# EAGLE schematic Washer Control Board (EAGLE 7.2.0)

## Sheet 1 of 3
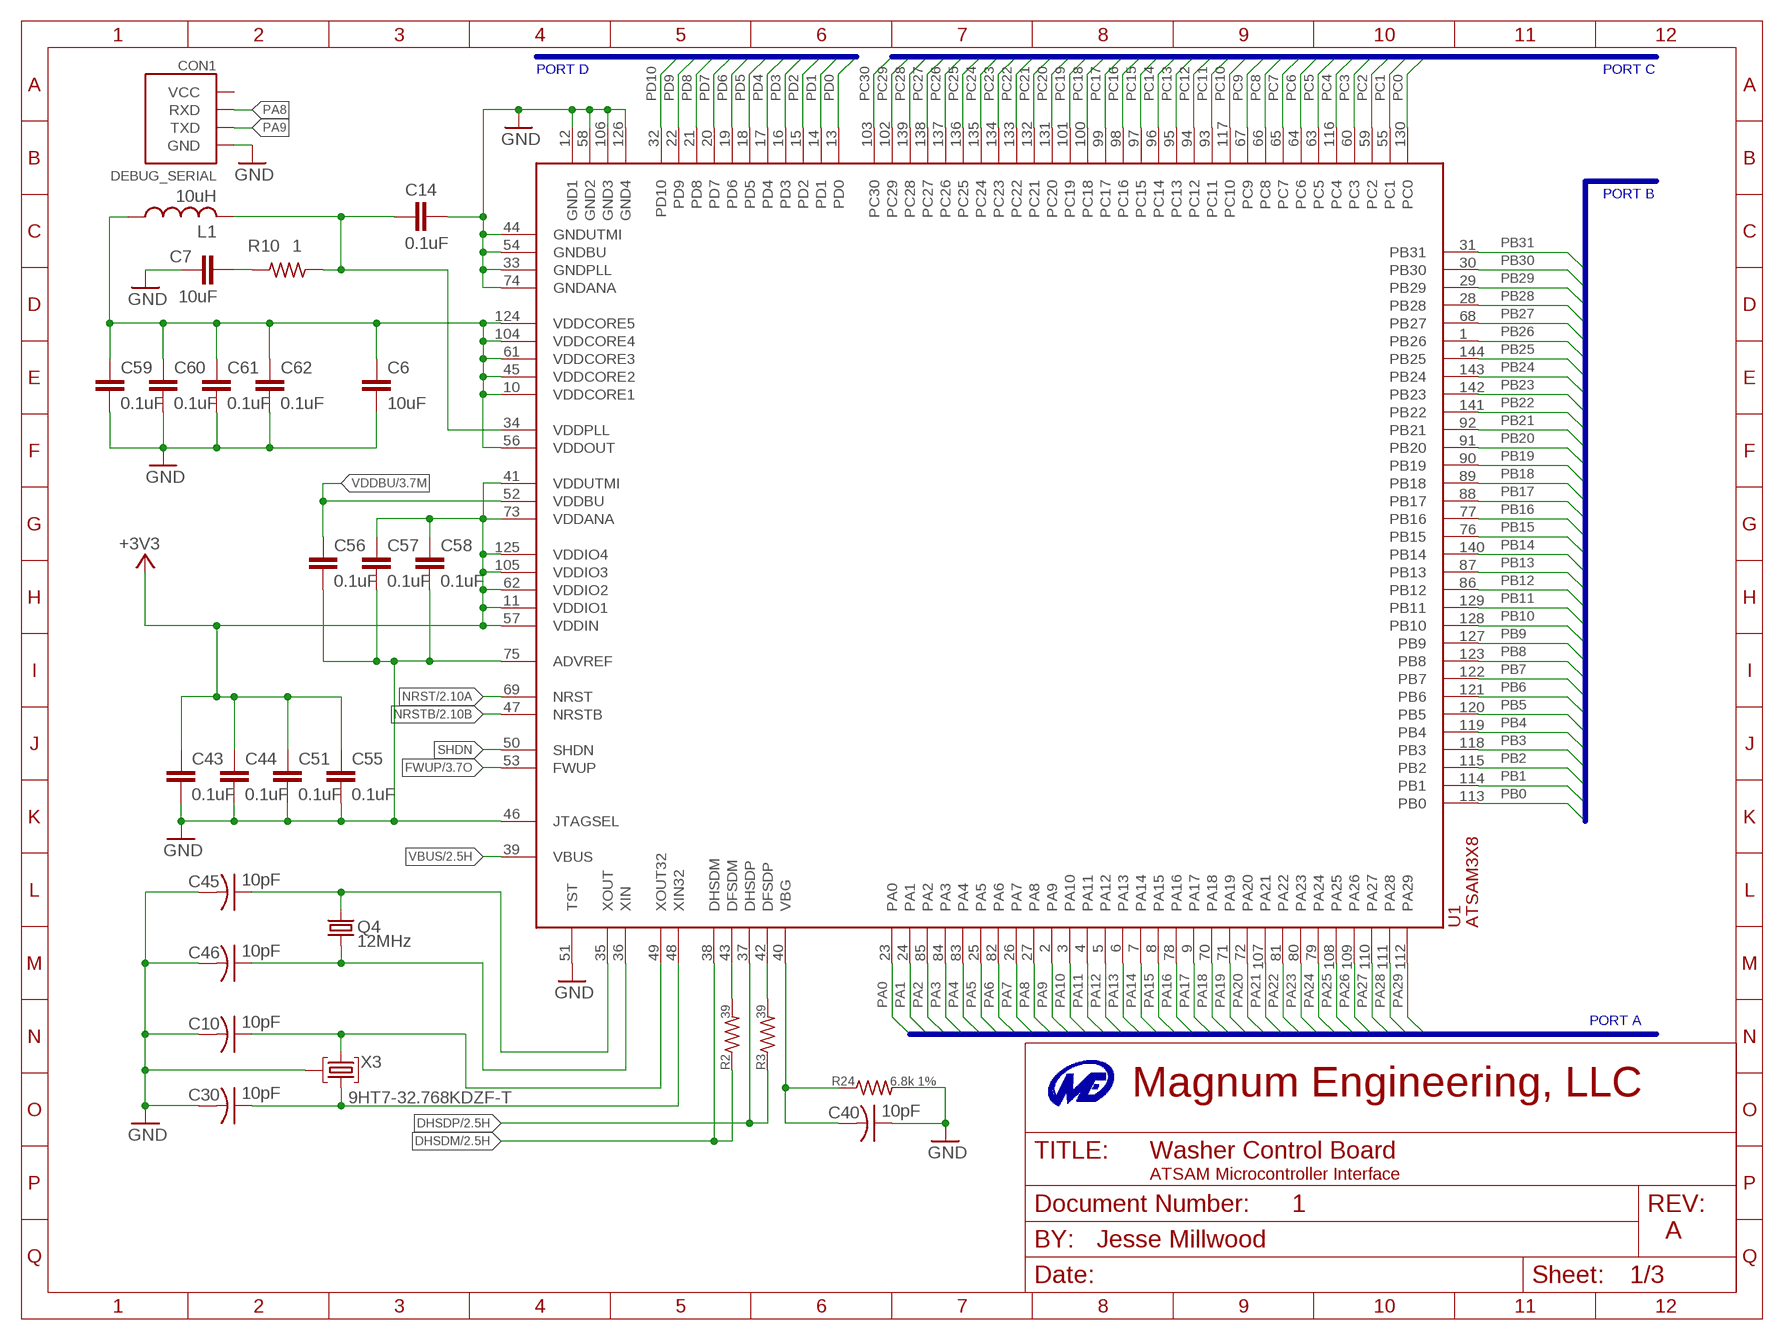
[diagram p0: schematic, sheet 1]
FRAME1 (MAGNUM-FRAME): AUTHOR: Jesse Millwood; DOC_NUM: 1; REV: A; SHEET_NAME: ATSAM Microcontroller Interface

### Parts
C6  10uF  C-EUC0805  [C0805]
C7  10uF  C-EUC0805  [C0805]
C10  10pF  CAPACITOR0805  [C0805]
C14  0.1uF  C-EUC0805  [C0805]
C30  10pF  CAPACITOR0805  [C0805]
C40  10pF  CAPACITOR0805  [C0805]
C43  0.1uF  C-EUC0805  [C0805]
C44  0.1uF  C-EUC0805  [C0805]
C45  10pF  CAPACITOR0805  [C0805]
C46  10pF  CAPACITOR0805  [C0805]
C51  0.1uF  C-EUC0805  [C0805]
C55  0.1uF  C-EUC0805  [C0805]
C56  0.1uF  C-EUC0805  [C0805]
C57  0.1uF  C-EUC0805  [C0805]
C58  0.1uF  C-EUC0805  [C0805]
C59  0.1uF  C-EUC0805  [C0805]
C60  0.1uF  C-EUC0805  [C0805]
C61  0.1uF  C-EUC0805  [C0805]
C62  0.1uF  C-EUC0805  [C0805]
CON1  DEBUG_SERIAL  VIDEO_PARTS_DEBUG_SERIAL  [VIDEO_PARTS_DEBUG_SERIAL]
L1  10uH  L-USL2012C  [L2012C]
Q4  12MHz  CRYSTALHC49UP  [HC49UP]
R2  39  RESISTOR0805  [R0805]
R3  39  RESISTOR0805  [R0805]
R10  1  R-US_R0805  [R0805]
R24  6.8k 1%  RESISTOR0805  [R0805]
U1  ATSAM3X8  SMARTPRJ_ATSAM3X/AAU  [SMARTPRJ_LQFP144]
X3  9HT7-32.768KDZF-T  CRYSTAL  [TXC-9HT7]

### Nets
+3V3: C43.1 C44.1 C51.1 C55.1 C57.1 C58.1 U1.11(VDDIO1) U1.41(VDDUTMI) U1.57(VDDIN) U1.62(VDDIO2) U1.73(VDDANA) U1.105(VDDIO3) U1.125(VDDIO4) ; also sheet 2,3
DHSDM: R2.1 U1.38(DHSDM) ; also sheet 2
DHSDP: R3.1 U1.37(DHSDP) ; also sheet 2
FWUP: U1.53(FWUP) ; also sheet 3
GND: C6.2 C7.1 C10.2 C14.2 C30.2 C40.1 C43.2 C44.2 C45.2 C46.2 C51.2 C55.2 C56.2 C57.2 C58.2 C59.2 C60.2 C61.2 C62.2 CON1.GND R24.2 U1.12(GND1) U1.33(GNDPLL) U1.44(GNDUTMI) U1.46(JTAGSEL) U1.51(TST) U1.54(GNDBU) U1.58(GND2) U1.74(GNDANA) U1.75(ADVREF) U1.106(GND3) U1.126(GND4) X3.2(GND) X3.3(GND) ; also sheet 2,3
N$6: C7.2 R10.2
N$8: C14.1 L1.2 R10.1 U1.34(VDDPLL)
N$9: R2.2 U1.43(DFSDM)
N$10: R3.2 U1.42(DFSDP)
N$45: C40.2 R24.1 U1.40(VBG)
N$51: C30.1 U1.48(XIN32) X3.1(X1)
N$55: C46.1 Q4.1 U1.36(XIN)
N$56: C45.1 Q4.2 U1.35(XOUT)
N$78: C10.1 U1.49(XOUT32) X3.4(X2)
NRST: U1.69(NRST) ; also sheet 2
NRSTB: U1.47(NRSTB) ; also sheet 2
PA0: U1.23(PA0) ; also sheet 2
PA1: U1.24(PA1) ; also sheet 2
PA2: U1.85(PA2) ; also sheet 2
PA3: U1.84(PA3)
PA4: U1.83(PA4)
PA5: U1.25(PA5)
PA6: U1.82(PA6) ; also sheet 2
PA7: U1.26(PA7)
PA8: CON1.RXD U1.27(PA8)
PA9: CON1.TXD U1.2(PA9)
PA10: U1.3(PA10)
PA11: U1.4(PA11)
PA12: U1.5(PA12)
PA13: U1.6(PA13)
PA14: U1.7(PA14)
PA15: U1.8(PA15)
PA16: U1.78(PA16)
PA17: U1.9(PA17)
PA18: U1.70(PA18)
PA19: U1.71(PA19) ; also sheet 2
PA20: U1.72(PA20) ; also sheet 2
PA21: U1.107(PA21) ; also sheet 2
PA22: U1.81(PA22) ; also sheet 2
PA23: U1.80(PA23) ; also sheet 2
PA24: U1.79(PA24)
PA25: U1.108(PA25)
PA26: U1.109(PA26)
PA27: U1.110(PA27)
PA28: U1.111(PA28)
PA29: U1.112(PA29)
PB0: U1.113(PB0) ; also sheet 2
PB1: U1.114(PB1) ; also sheet 2
PB2: U1.115(PB2) ; also sheet 2
PB3: U1.118(PB3) ; also sheet 2
PB4: U1.119(PB4) ; also sheet 2
PB5: U1.120(PB5) ; also sheet 2
PB6: U1.121(PB6) ; also sheet 2
PB7: U1.122(PB7) ; also sheet 2
PB8: U1.123(PB8) ; also sheet 2
PB9: U1.127(PB9) ; also sheet 2
PB10: U1.128(PB10) ; also sheet 2
PB11: U1.129(PB11)
PB12: U1.86(PB12)
PB13: U1.87(PB13)
PB14: U1.140(PB14)
PB15: U1.76(PB15)
PB16: U1.77(PB16) ; also sheet 2
PB17: U1.88(PB17) ; also sheet 2
PB18: U1.89(PB18) ; also sheet 2
PB19: U1.90(PB19) ; also sheet 2
PB20: U1.91(PB20) ; also sheet 2
PB21: U1.92(PB21)
PB22: U1.141(PB22)
PB23: U1.142(PB23)
PB24: U1.143(PB24)
PB25: U1.144(PB25) ; also sheet 3
PB26: U1.1(PB26)
PB27: U1.68(PB27)
PB28: U1.28(PB28) ; also sheet 2
PB29: U1.29(PB29) ; also sheet 2
PB30: U1.30(PB30)
PB31: U1.31(PB31) ; also sheet 2
PC0: U1.130(PC0) ; also sheet 2
PC1: U1.55(PC1)
PC2: U1.59(PC2) ; also sheet 2
PC3: U1.60(PC3) ; also sheet 2
PC4: U1.116(PC4) ; also sheet 2
PC5: U1.63(PC5) ; also sheet 2
PC6: U1.64(PC6) ; also sheet 2
PC7: U1.65(PC7) ; also sheet 2
PC8: U1.66(PC8) ; also sheet 2
PC9: U1.67(PC9) ; also sheet 2
PC10: U1.117(PC10)
PC11: U1.93(PC11)
PC12: U1.94(PC12)
PC13: U1.95(PC13)
PC14: U1.96(PC14)
PC15: U1.97(PC15)
PC16: U1.98(PC16)
PC17: U1.99(PC17)
PC18: U1.100(PC18)
PC19: U1.101(PC19) ; also sheet 2
PC20: U1.131(PC20) ; also sheet 2
PC21: U1.132(PC21) ; also sheet 3
PC22: U1.133(PC22) ; also sheet 2
PC23: U1.134(PC23)
PC24: U1.135(PC24)
PC25: U1.136(PC25)
PC26: U1.137(PC26)
PC27: U1.138(PC27)
PC28: U1.139(PC28)
PC29: U1.102(PC29)
PC30: U1.103(PC30)
PD0: U1.13(PD0)
PD1: U1.14(PD1)
PD2: U1.15(PD2)
PD3: U1.16(PD3)
PD4: U1.17(PD4)
PD5: U1.18(PD5)
PD6: U1.19(PD6)
PD7: U1.20(PD7)
PD8: U1.21(PD8) ; also sheet 2
PD9: U1.22(PD9) ; also sheet 2
PD10: U1.32(PD10)
SHDN: U1.50(SHDN)
VBUS: U1.39(VBUS) ; also sheet 2
VDDBU: C56.1 U1.52(VDDBU) ; also sheet 3
VDDCORE: C6.1 C59.1 C60.1 C61.1 C62.1 L1.1 U1.10(VDDCORE1) U1.45(VDDCORE2) U1.56(VDDOUT) U1.61(VDDCORE3) U1.104(VDDCORE4) U1.124(VDDCORE5)
Unconnected: CON1.VCC

### Buses
PB0,PB1,PB2,PB3,PB4,PB5,PB6,PB7,PB8,PB9,PB10,PB11,PB12,PB13,PB14,PB15,PB16,PB17,PB18,PB19,PB20,PB21,PB22,PB23,PB24,PB25,PB26,PB27,PB28,PB29,PB30,PB31
PC0,PC1,PC2,PC3,PC4,PC5,PC6,PC7,PC8,PC9,PC9,PC10,PC11,PC12,PC13,PC14,PC15,PC16,PC17,PC18,PC19,PC20,PC21,PC22,PC23,PC24,PC25,PC26,PC27,PC28,PC29,PC30
PD0,PD1,PD2,PD3,PD4,PD5,PD6,PD7,PD8,PD9,PD10
PA0,PA1,PA2,PA3,PA4,PA5,PA6,PA7,PA8,PA9,PA10,PA10,PA11,PA12,PA13,PA14,PA15,PA16,PA17,PA18,PA19,PA20,PA21,PA22,PA23,PA24,PA25,PA26,PA27,PA28,PA29

### Notes on the sheet
- PORT D | PORT C
- PORT B
- PORT A

## Sheet 2 of 3
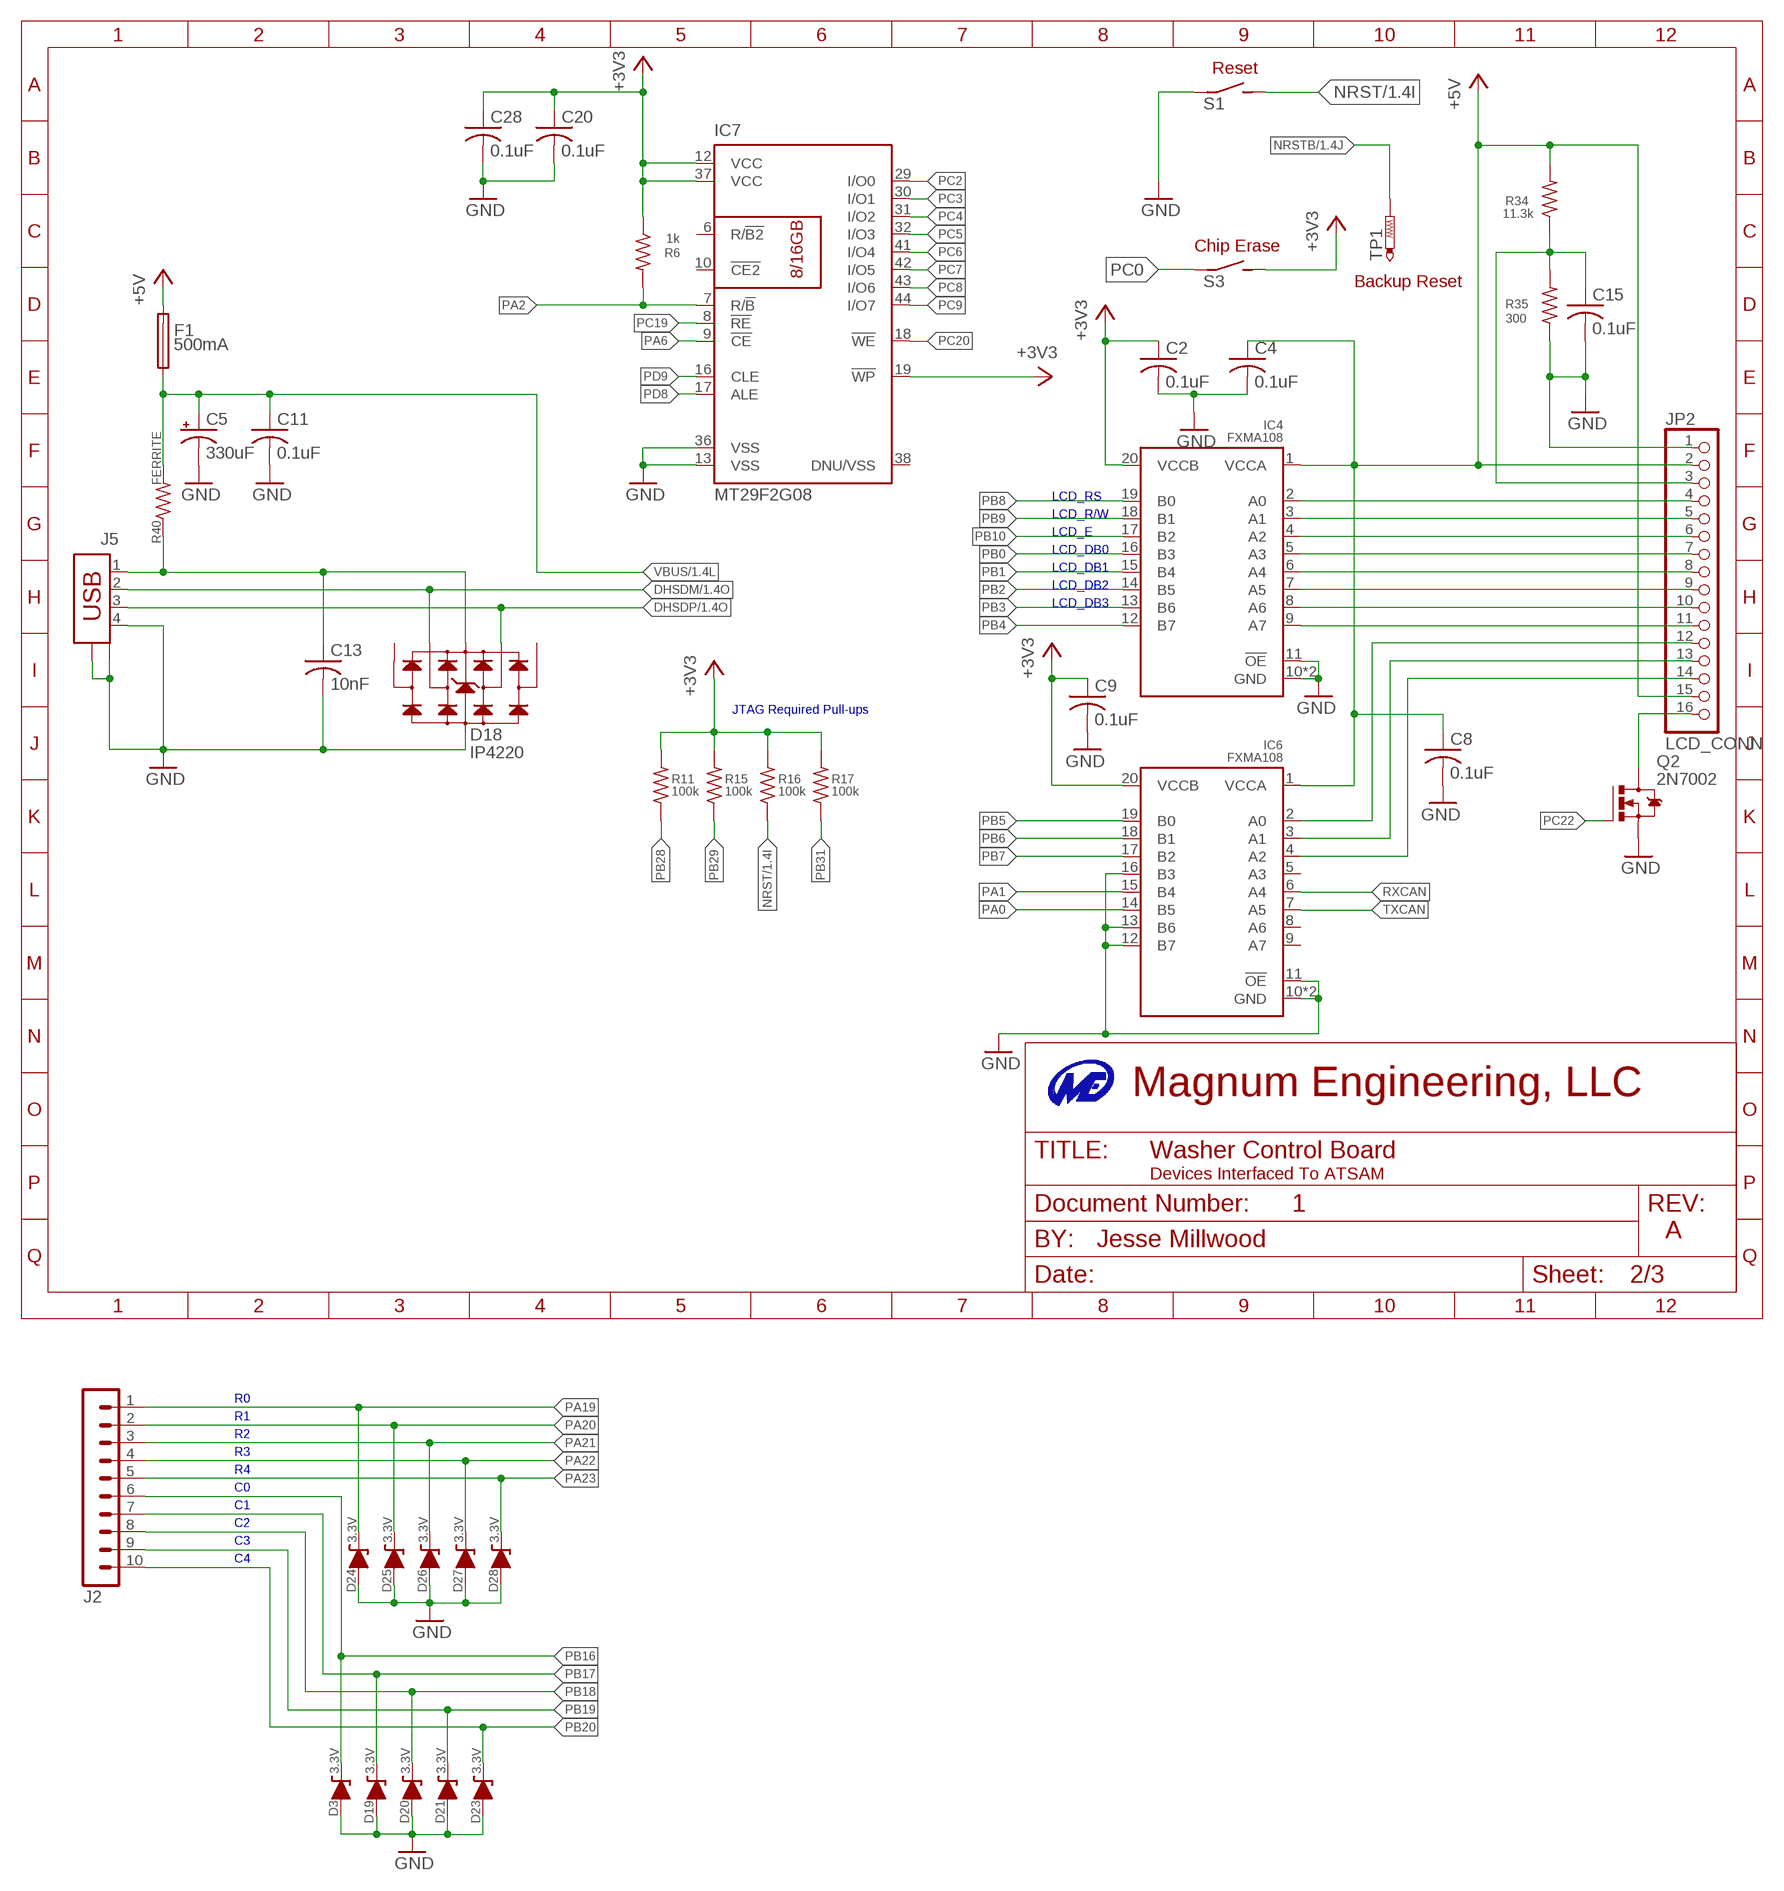
[diagram p1: schematic, sheet 2]
FRAME2 (MAGNUM-FRAME): AUTHOR: Jesse Millwood; DOC_NUM: 1; REV: A; SHEET_NAME: Devices Interfaced To ATSAM

### Parts
C2  0.1uF  CAPACITOR0805  [C0805]
C4  0.1uF  CAPACITOR0805  [C0805]
C5  330uF  CPOL-USE2.5-6  [E2,5-6]
C8  0.1uF  CAPACITOR0805  [C0805]
C9  0.1uF  CAPACITOR0805  [C0805]
C11  0.1uF  CAPACITOR0805  [C0805]
C13  10nF  CAPACITOR0805  [C0805]
C15  0.1uF  CAPACITOR0805  [C0805]
C20  0.1uF  CAPACITOR0805  [C0805]
C28  0.1uF  CAPACITOR0805  [C0805]
D3  3.3V  ZENERSOT-23  [SOT-23]
D18  IP4220  [SOT-23-6]
D19  3.3V  ZENERSOT-23  [SOT-23]
D20  3.3V  ZENERSOT-23  [SOT-23]
D21  3.3V  ZENERSOT-23  [SOT-23]
D23  3.3V  ZENERSOT-23  [SOT-23]
D24  3.3V  ZENERSOT-23  [SOT-23]
D25  3.3V  ZENERSOT-23  [SOT-23]
D26  3.3V  ZENERSOT-23  [SOT-23]
D27  3.3V  ZENERSOT-23  [SOT-23]
D28  3.3V  ZENERSOT-23  [SOT-23]
F1  500mA  FUSELITTELFUSE1812  [LITTELFUSE1812]
IC4  FXMA108  [20DQFN]
IC6  FXMA108  [20DQFN]
IC7  MT29F2G08  MT29F8G08DAA  [TSOP48]
J2  MA10-152271  [52271-1069]
J5  USB-787616  [USB]
JP2  LCD_CONN  PINHD-1X16  [1X16]
Q2  2N7002  [SOT-23]
R6  1k  R-US_R0805  [R0805]
R11  100k  RESISTOR0805  [R0805]
R15  100k  RESISTOR0805  [R0805]
R16  100k  RESISTOR0805  [R0805]
R17  100k  RESISTOR0805  [R0805]
R34  11.3k  R-US_R0805  [R0805]
R35  300  R-US_R0805  [R0805]
R40  FERRITE  RESISTOR0805  [R0805]
S1  Reset  SPST2EVQPJ  [EVQPJ]
S3  Chip Erase  SPST2EVQPJ  [EVQPJ]
TP1  PTR1TP06R  [TP06R]

### Nets
+3V3: C2.1 C9.1 C20.1 C28.1 IC4.20(VCCB) IC6.20(VCCB) IC7.12(VCC) IC7.19(!WP) IC7.37(VCC) R6.1 R11.2 R15.2 R16.2 R17.2 S3.B ; also sheet 1,3
+5V [Power]: C4.1 C8.1 F1.P$2 IC4.1(VCCA) IC6.1(VCCA) JP2.2 JP2.15 R34.2 ; also sheet 3
DHSDM: D18.6 J5.2 ; also sheet 1
DHSDP: D18.4 J5.3 ; also sheet 1
GND: C2.2 C4.2 C5.- C8.2 C9.2 C11.2 C13.2 C15.2 C20.2 C28.2 D3.1(A) D18.2(GND) D19.1(A) D20.1(A) D21.1(A) D23.1(A) D24.1(A) D25.1(A) D26.1(A) D27.1(A) D28.1(A) IC4.10(GND) IC4.11(!OE) IC4.PAD(GND) IC6.10(GND) IC6.11(!OE) IC6.12(B7) IC6.13(B6) IC6.16(B3) IC6.PAD(GND) IC7.13(VSS) IC7.36(VSS) J5.4 J5.P$1 J5.P$2 JP2.1 Q2.2(S) R35.1 S1.A ; also sheet 1,3
N$3: IC4.9(A7) JP2.11
N$12: IC6.2(A0) JP2.12
N$18: IC4.2(A0) JP2.4
N$24: IC4.3(A1) JP2.5
N$26: IC4.4(A2) JP2.6
N$34: IC4.5(A3) JP2.7
N$35: IC4.6(A4) JP2.8
N$39: IC6.3(A1) JP2.13
N$40: IC6.4(A2) JP2.14
N$41: IC4.7(A5) JP2.9
N$42: IC4.8(A6) JP2.10
N$44: JP2.16 Q2.3(D)
N$46: C15.1 JP2.3 R34.1 R35.2
NRST: R16.1 S1.B ; also sheet 1
NRSTB: TP1.TP ; also sheet 1
PA0: IC6.14(B5) ; also sheet 1
PA1: IC6.15(B4) ; also sheet 1
PA2: IC7.7(R/!B) R6.2 ; also sheet 1
PA6: IC7.9(!CE) ; also sheet 1
PA19: D24.3(K) J2.1 ; also sheet 1
PA20: D25.3(K) J2.2 ; also sheet 1
PA21: D26.3(K) J2.3 ; also sheet 1
PA22: D27.3(K) J2.4 ; also sheet 1
PA23: D28.3(K) J2.5 ; also sheet 1
PB0: IC4.16(B3) ; also sheet 1
PB1: IC4.15(B4) ; also sheet 1
PB2: IC4.14(B5) ; also sheet 1
PB3: IC4.13(B6) ; also sheet 1
PB4: IC4.12(B7) ; also sheet 1
PB5: IC6.19(B0) ; also sheet 1
PB6: IC6.18(B1) ; also sheet 1
PB7: IC6.17(B2) ; also sheet 1
PB8: IC4.19(B0) ; also sheet 1
PB9: IC4.18(B1) ; also sheet 1
PB10: IC4.17(B2) ; also sheet 1
PB16: D3.3(K) J2.6 ; also sheet 1
PB17: D19.3(K) J2.7 ; also sheet 1
PB18: D20.3(K) J2.8 ; also sheet 1
PB19: D21.3(K) J2.9 ; also sheet 1
PB20: D23.3(K) J2.10 ; also sheet 1
PB28: R11.1 ; also sheet 1
PB29: R15.1 ; also sheet 1
PB31: R17.1 ; also sheet 1
PC0: S3.A ; also sheet 1
PC2: IC7.29(I/O0) ; also sheet 1
PC3: IC7.30(I/O1) ; also sheet 1
PC4: IC7.31(I/O2) ; also sheet 1
PC5: IC7.32(I/O3) ; also sheet 1
PC6: IC7.41(I/O4) ; also sheet 1
PC7: IC7.42(I/O5) ; also sheet 1
PC8: IC7.43(I/O6) ; also sheet 1
PC9: IC7.44(I/O7) ; also sheet 1
PC19: IC7.8(!RE) ; also sheet 1
PC20: IC7.18(!WE) ; also sheet 1
PC22: Q2.1(G) ; also sheet 1
PD8: IC7.17(ALE) ; also sheet 1
PD9: IC7.16(CLE) ; also sheet 1
RXCAN: IC6.6(A4)
TXCAN: IC6.7(A5)
USB_V+: C13.1 D18.5(VBUS) J5.1 R40.1
VBUS: C5.+ C11.1 F1.P$1 R40.2 ; also sheet 1
Unconnected: D18.1 D18.3 IC6.5(A3) IC6.8(A6) IC6.9(A7) IC7.6(R/!B2) IC7.10(!CE2) IC7.25(DNU) IC7.26(DNU) IC7.38(DNU/VSS) IC7.48(DNU)

### Notes on the sheet
- Reset
- Chip Erase
- Backup Reset
- LCD_RS
- LCD_R/W
- LCD_E
- LCD_DB0
- LCD_DB1
- LCD_DB2
- LCD_DB3
- JTAG Required Pull-ups
- R0
- R1
- R2
- R3
- R4
- C0
- C1
- C2
- C3
- C4

## Sheet 3 of 3
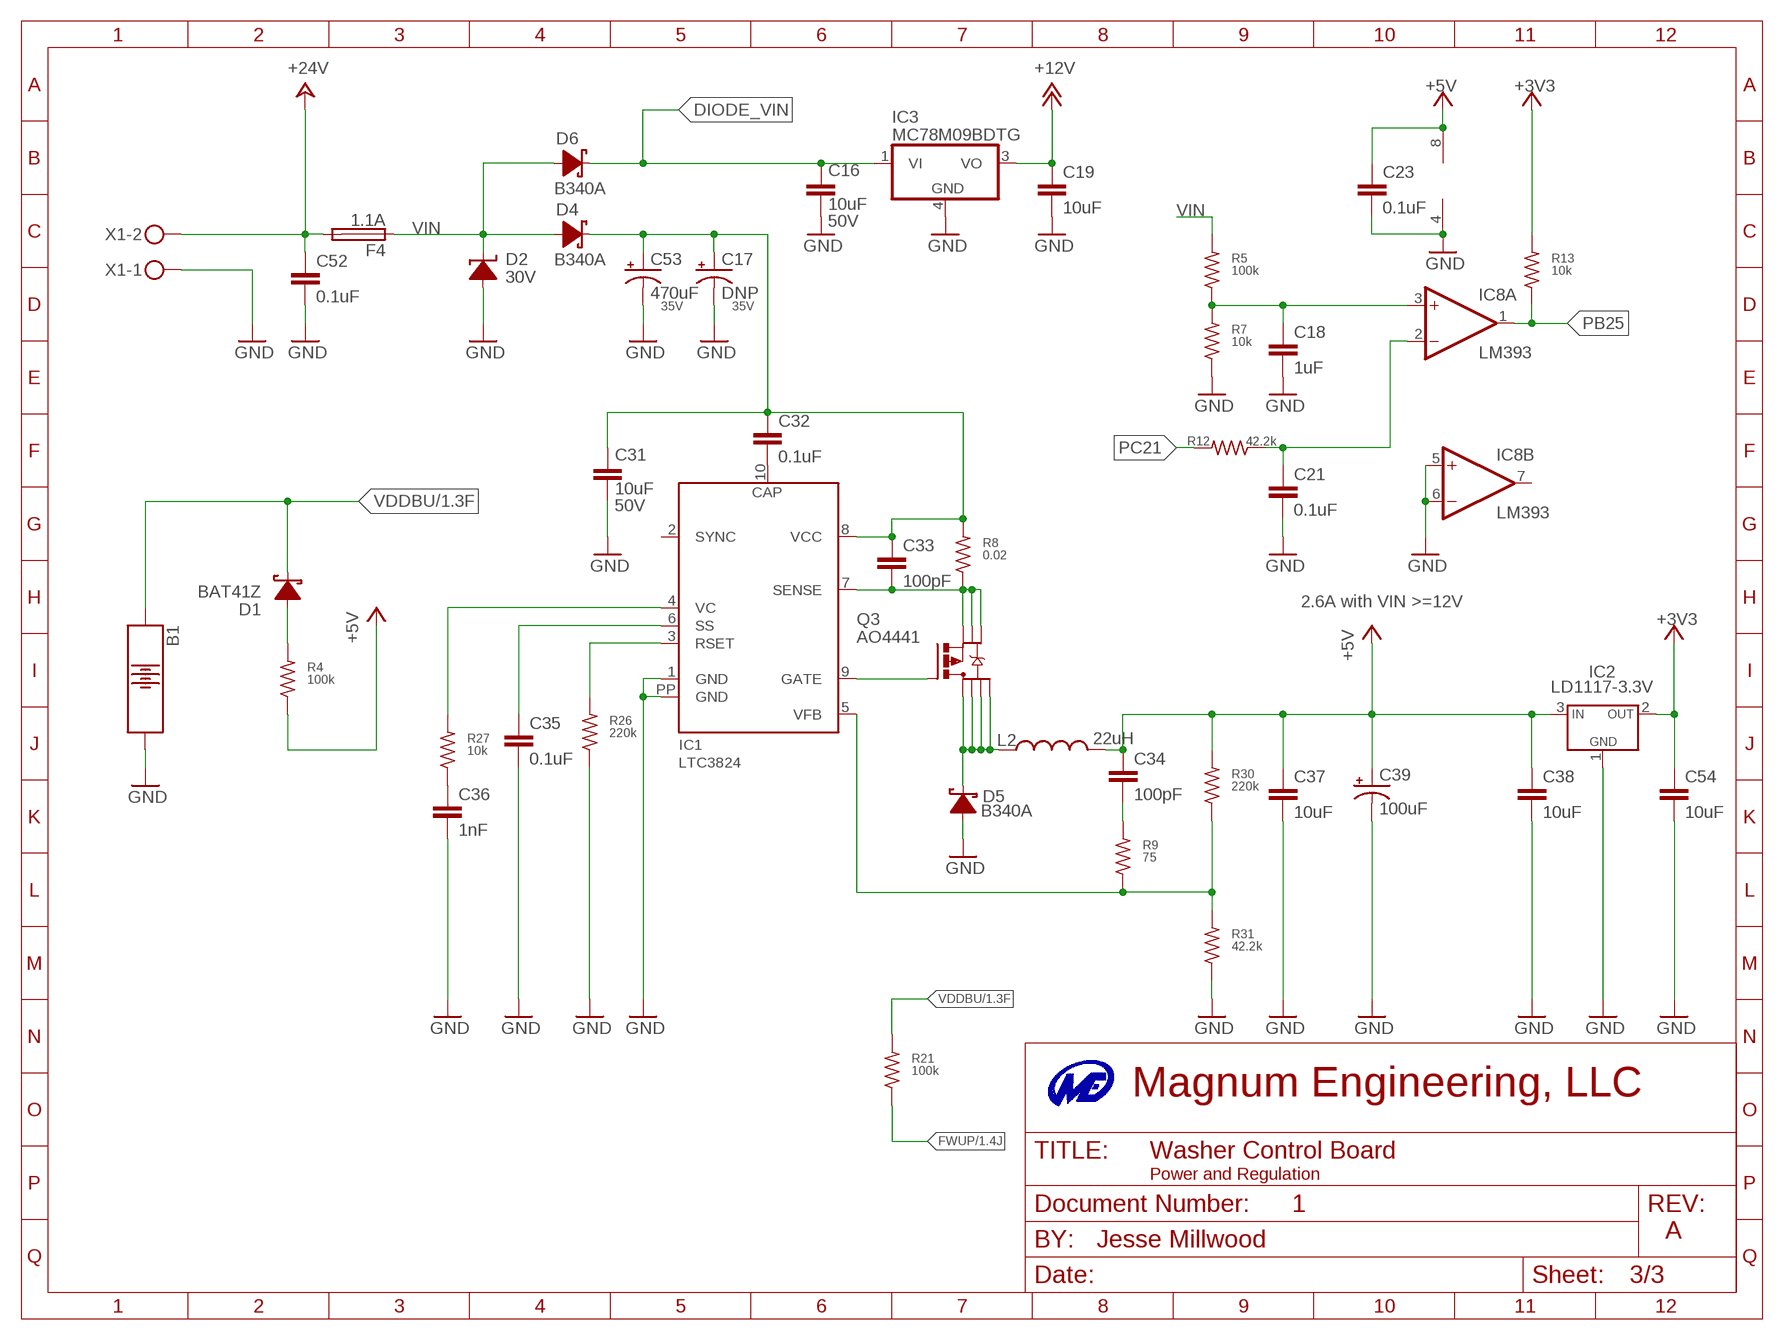
[diagram p2: schematic, sheet 3]
FRAME3 (MAGNUM-FRAME): AUTHOR: Jesse Millwood; DOC_NUM: 1; REV: A; SHEET_NAME: Power and Regulation

### Parts
B1  BS-7-ND  [BS-7-BATTERY-HOLDER]
C16  10uF  C-EUC1206  [C1206]
C17  DNP  POL-CAPACITOR5-10.5  [RCL_E5-10,5]
C18  1uF  C-EUC0805  [C0805]
C19  10uF  C-EUC0805  [C0805]
C21  0.1uF  C-EUC0805  [C0805]
C23  0.1uF  C-EUC0805  [C0805]
C31  10uF  C-EUC1206  [C1206]
C32  0.1uF  C-EUC0805  [C0805]
C33  100pF  C-EUC0805  [C0805]
C34  100pF  C-EUC0805  [C0805]
C35  0.1uF  C-EUC0805  [C0805]
C36  1nF  C-EUC0805  [C0805]
C37  10uF  C-EUC0805  [C0805]
C38  10uF  C-EUC0805  [C0805]
C39  100uF  POL-CAPACITOR2-5  [RCL_E2-5]
C52  0.1uF  C-EUC0805  [C0805]
C53  470uF  POL-CAPACITOR5-10.5  [RCL_E5-10,5]
C54  10uF  C-EUC0805  [C0805]
D1  BAT41Z  DIODE-SCHOTTKYSOD123  [SOD123@1]
D2  30V  TVSSMA  [SMA@2]
D4  B340A  DIODE-SCHOTTKYSMA  [SMA]
D5  B340A  DIODE-SCHOTTKYSMA  [SMA@1]
D6  B340A  DIODE-SCHOTTKYSMA  [SMA]
F4  1.1A  FUSELITTELFUSE1812  [LITTELFUSE1812]
IC1  LTC3824  [MSOP10-PPPP]
IC2  LD1117-3.3V  VREGLD1117-XX  [DPAK]
IC3  MC78M09BDTG  [DPACK_3]
IC8  LM393  LM293  [SO-08]
L2  22uH  L-USSRR1280  [SRR1280]
Q3  AO4441  MOSFET-P-SO8  [SO8.MOSFETN]
R4  100k  RESISTOR0805  [R0805]
R5  100k  RESISTOR0805  [R0805]
R7  10k  RESISTOR0805  [R0805]
R8  0.02  RESISTOR0805  [R0805]
R9  75  RESISTOR0805  [R0805]
R12  42.2k  RESISTOR0805  [R0805]
R13  10k  RESISTOR0805  [R0805]
R21  100k  RESISTOR0805  [R0805]
R26  220k  RESISTOR0805  [R0805]
R27  10k  RESISTOR0805  [R0805]
R30  220k  RESISTOR0805  [R0805]
R31  42.2k  RESISTOR0805  [R0805]
X1  MKDSN1,5/2-5,08  [MKDSN1,5/2-5,08]

### Nets
+3V3: C54.1 IC2.2(OUT) R13.2 ; also sheet 1,2
+5V [Power]: C23.1 C34.1 C37.1 C38.1 C39.+ IC2.3(IN) IC8.8(P:V+) L2.P$2 R4.1 R30.2 ; also sheet 2
+12V [Power]: C19.1 IC3.3(VO)
+24V: C52.1 F4.P$2 X1.2
DIODE_VIN: C16.1 D6.C IC3.1(VI)
FWUP: R21.1 ; also sheet 1
GND: B1.-(B-) C16.2 C17.- C18.2 C19.2 C21.2 C23.2 C31.2 C35.2 C36.2 C37.2 C38.2 C39.- C52.2 C53.- C54.2 D2.A D5.A IC1.1(GND) IC1.PP(GND) IC2.1(GND) IC3.4(GND) IC8.4(P:V-) IC8.5(B:+IN) IC8.6(B:-IN) R7.1 R26.1 R31.1 X1.1 ; also sheet 1,2
N$4: IC1.9(GATE) Q3.G
N$11: D1.A R4.2
N$13: C18.1 IC8.3(A:+IN) R5.1 R7.2
N$14: C21.1 IC8.2(A:-IN) R12.1
N$19: C32.2 IC1.10(CAP)
N$21: C33.2 IC1.7(SENSE) Q3.S$1(S1) Q3.S$2(S2) Q3.S$3(S3) R8.1
N$22: C34.2 R9.2
N$23: IC1.3(RSET) R26.2
N$27: C35.1 IC1.6(SS)
N$28: IC1.4(VC) R27.2
N$29: C36.1 R27.1
N$32: IC1.5(VFB) R9.1 R30.1 R31.2
N$38: C17.+ C31.1 C32.1 C33.1 C53.+ D4.C IC1.8(VCC) R8.2
N$48: D5.C L2.P$1 Q3.D$1(D1) Q3.D$2(D2) Q3.D$3(D3) Q3.D$4(D4)
PB25: IC8.1(A:OUT) R13.1 ; also sheet 1
PC21: R12.2 ; also sheet 1
VDDBU: B1.+(B+) D1.K(C) R21.2 ; also sheet 1
VIN: D2.C D4.A D6.A F4.P$1 R5.2
Unconnected: IC1.2(SYNC) IC8.7(B:OUT)

### Notes on the sheet
- 2.6A with VIN >=12V

## Library data of the parts
B1 = Magnum:BS-7-ND
C2 C4 C8-C11 C13 C15 C20 C28 C30 C40 C45 C46 = Magnum Stock Parts:CAPACITOR
C5 = rcl:CPOL-US: POLARIZED CAPACITOR, American symbol
C6 C7 C14 C18 C19 C21 C23 C32-C38 C43 C44 C51 C52 C54-C62 = rcl:C-EU: CAPACITOR, European symbol
C16 C31 = rcl:C-EU: CAPACITOR, European symbol; VOLTAGE: 50V
C17 C53 = Magnum Stock Parts:POL-CAPACITOR; VOLTAGE: 35V
C39 = Magnum Stock Parts:POL-CAPACITOR
CON1 = PCB-SMCXc-SEv6.0:VIDEO_PARTS_DEBUG_SERIAL
D1 = ads4:DIODE-SCHOTTKY: Schottky Diode; LEAKAGE: Ileak=100nA
D2 = ads4:TVS: 2-terminal Transient Voltage Suppressor
D3 D19-D21 D23-D28 = Magnum Stock Parts:ZENER: Zener Diode
D4 D6 = Magnum Stock Parts:DIODE-SCHOTTKY: Schottky Diode
D5 = ads4:DIODE-SCHOTTKY: Schottky Diode
D18 = Magnum Stock Parts:IP4220: NXP 4-channel USB TVS 8kV
F1 = ads4:FUSE: Fuse
F4 = Magnum:FUSE: Fuse
IC1 = Magnum:LTC3824
IC2 = Magnum Stock Parts:VREG
IC3 = linear:MC78M: 500 mA Positive Voltage Regulators Source: Data sheet <http://www.onsemi.com/pub_link/Collateral/MC78M00-D.PDF>
IC4 = Magnum:FXMA108
IC6 = Magnum:FXMA108; DIGI-NO: 742-ND
IC7 = memory-micron:MT29F8G08DAA: 4Gb, 8Gb, and 16Gb x8 NAND Flash Memory Source: http://download.micron.com/pdf/datasheets/flash/nand/4gb_nand_m40a.pdf; OC_FARNELL: unknown; OC_NEWARK: unknown
IC8 = Magnum Stock Parts:LM293: COMPARATOR
J2 = Magnum:MA10-1: PIN HEADER
J5 = Magnum:USB-787616: AMP connector
JP2 = FLC:PINHD-1X16: PIN HEADER
L1 = rcl:L-US: INDUCTOR, American symbol
L2 = Magnum:L-US: INDUCTOR, American symbol
Q2 = ads4:2N7002: 2N7002 N-channel Logic-Level MOSFET
Q3 = ads4:MOSFET-P-SO8: P-Channel MOSFET SO8
Q4 = crystal:CRYSTAL: CRYSTAL; OC_FARNELL: unknown; OC_NEWARK: unknown
R2-R5 R7-R9 R11-R13 R15-R17 R21 R24 R26 R27 R30 R31 R40 = Magnum Stock Parts:RESISTOR
R6 R10 R34 R35 = rcl:R-US_: RESISTOR, American symbol
S1 S3 = Magnum:SPST2: SPST Switch
TP1 = testpad:PTR1: TEST PIN
U1 = Arduino_DUE_V02b:SMARTPRJ_ATSAM3X/A
X1 = con-phoenix-508:MKDSN1,5/2-5,08: MKDSN 1,5/ 2-5,08 Printklemme Nennstrom: 13,5 A Nennspannung: 250 V Rastermaß: 5,08 mm Polzahl: 2 Anschlussart: Schraubanschluss Montage: Löten Anschlussrichtung Leiter/Platine: 0 ° Artikelnummer: 1729128 Source: http://eshop.phoenixcontact.com .. 1729128.pdf; MPN: MKDSN 1,5/2-5.08; OC_FARNELL: 1792903; OC_NEWARK: 30M2397
X3 = Magnum:CRYSTAL

## Net classes
0 default: width 0.152 mm, drill 0.381 mm, clearance 0.152 mm
1 Power: width 0.152 mm, drill 0.381 mm, clearance 0.203 mm